# Altium schematic sheet JTAG&Trace.SchDoc
size A4; Revision: C.2(PCB.SCH)
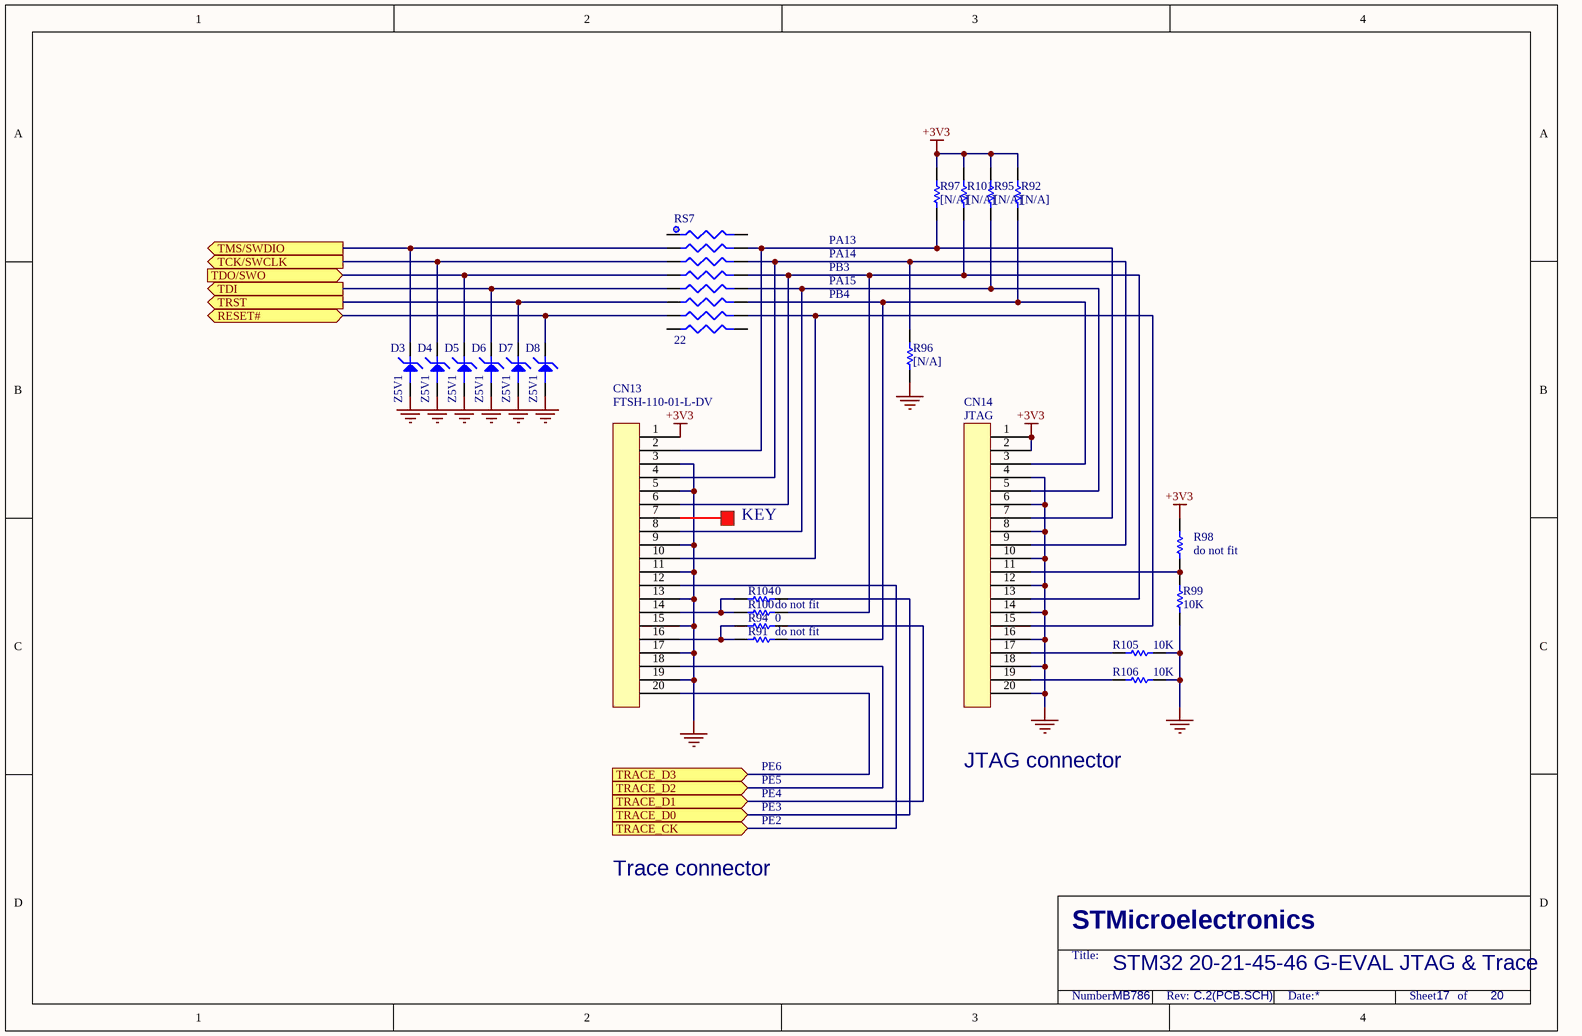
[diagram p0: JTAG&Trace.SchDoc]

## Parts
CN13  FTSH-110-01-L-DV  [FTSH-110-01-L-DV]
CN14  JTAG  [IDC20L]
D3  Z5V1  [SOT-23]
D4  Z5V1  [SOT-23]
D5  Z5V1  [SOT-23]
D6  Z5V1  [SOT-23]
D7  Z5V1  [SOT-23]
D8  Z5V1  [SOT-23]
R91  do not fit  [0603R]
R92  [N/A]  [0603R]
R94  0  [0603R]
R95  [N/A]  [0603R]
R96  [N/A]  [0603R]
R97  [N/A]  [0603R]
R98  do not fit  [0603R]
R99  10K  [0402R]
R100  do not fit  [0603R]
R101  [N/A]  [0603R]
R104  0  [0603R]
R105  10K  [0402R]
R106  10K  [0402R]
RS7  22  [RES8B_0402]

## Ports
RESET# (bidir), TCK/SWCLK (out), TDI (out), TDO/SWO (in), TMS/SWDIO (out), TRACE_CK (in), TRACE_D0 (in), TRACE_D1 (in), TRACE_D2 (in), TRACE_D3 (in), TRST (out)

## Nets
+3V3: CN13.1 CN14.1 CN14.2 R92.2 R95.2 R97.2 R98.2 R101.2
GND: CN13.3 CN13.5 CN13.9 CN13.11 CN13.13 CN13.15 CN13.17 CN13.19 CN14.4 CN14.6 CN14.8 CN14.10 CN14.12 CN14.14 CN14.16 CN14.18 CN14.20 D3.2 D4.2 D5.2 D6.2 D7.2 D8.2 R96.1 R99.1 R105.2 R106.2
RESET#: D8.3 RS7.13 ; port RESET#
TCK/SWCLK: D4.3 RS7.5 ; port TCK/SWCLK
TDI: D6.3 RS7.9 ; port TDI
TDO/SWO: D5.3 RS7.7 ; port TDO/SWO
TMS/SWDIO: D3.3 RS7.3 ; port TMS/SWDIO
TRACE_CK: CN13.12 ; port TRACE_CK
TRACE_D0: R104.2 ; port TRACE_D0
TRACE_D1: R94.2 ; port TRACE_D1
TRACE_D2: CN13.18 ; port TRACE_D2
TRACE_D3: CN13.20 ; port TRACE_D3
TRST: D7.3 RS7.11 ; port TRST
NetCN13_2: CN13.2 CN14.7 R97.1 RS7.4
NetCN13_4: CN13.4 CN14.9 R96.2 RS7.6
NetCN13_6: CN13.6 CN14.13 R100.2 R101.1 RS7.8
NetCN13_8: CN13.8 CN14.5 R95.1 RS7.10
NetCN13_10: CN13.10 CN14.15 RS7.14
NetCN13_14: CN13.14 R100.1 R104.1
NetCN13_16: CN13.16 R91.1 R94.1
NetCN14_3: CN14.3 R91.2 R92.1 RS7.12
NetCN14_11: CN14.11 R98.1 R99.2
NetCN14_17: CN14.17 R105.1
NetCN14_19: CN14.19 R106.1

Not connected (* = marked no-connect by the designer): CN13 7; RS7 1 2 15 16

## Notes on the sheet
- PA13
- PA14
- PB3
- PA15
- PB4
- KEY
- PE6
- PE5
- JTAG connector
- PE4
- PE3
- PE2
- Trace connector
- STM32 20-21-45-46 G-EVAL JTAG & Trace
- MB786
- 17
- 20
- STMicroelectronics
- Title:
- Number:
- Rev:
- Date:
- Sheet       of

## Library data of the parts
CN13 CN14 = 20PIN1
D3-D8 = Z5V6
R91 R92 R94-R101 R104-R106 = Res1: Resistor; Value: 1K; Published: 8-Jun-2000; Revision: July-2002: Re-released for DXP Platform.; Publisher: Altium Limited
RS7 = RES8B